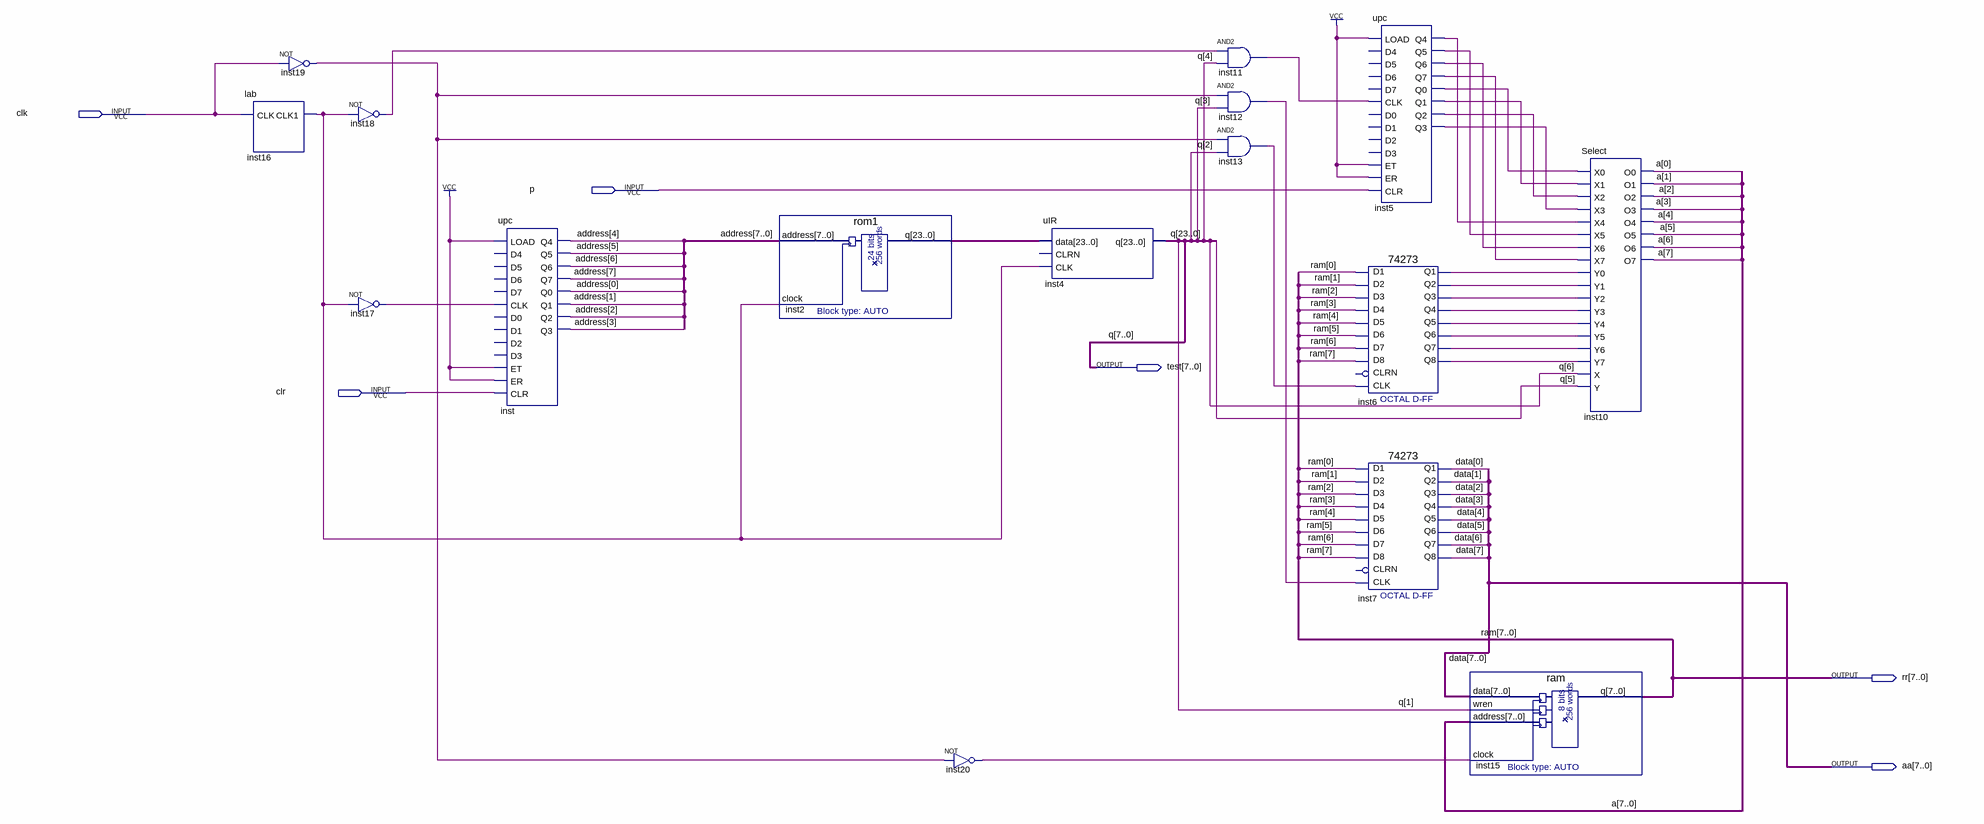
[diagram p0: schematic sheet]
// Quartus schematic lab2.bdf as structural Verilog: 16 symbols, 6 pins
module lab2 (
  input  clk,
  input  p,
  input  clr,
  output [7:0] test,
  output [7:0] rr,
  output [7:0] aa
);

  wire inst5_q0, inst5_q1, inst5_q2, inst5_q3, inst5_q4, inst5_q5, inst5_q6, inst5_q7, inst6_q1, inst6_q2,
       inst6_q3, inst6_q4, inst6_q5, inst6_q6, inst6_q7, inst6_q8, inst11_out, inst12_out, inst13_out,
       inst16_clk1, inst17_out, inst18_out, inst19_out, inst20_out;
  wire [7:0] a, address;
  wire [23:0] inst2_q;
  wire [23:8] q;

  lab inst16 (.CLK(clk), .CLK1(inst16_clk1));
  not inst19 (inst19_out, clk);
  not inst18 (inst18_out, inst16_clk1);
  not inst17 (inst17_out, inst16_clk1);
  upc inst (
    .LOAD(1'b1), .CLK(inst17_out), .ET(1'b1), .ER(1'b1), .CLR(clr), .Q4(address[4]), .Q5(address[5]),
    .Q6(address[6]), .Q7(address[7]), .Q0(address[0]), .Q1(address[1]), .Q2(address[2]), .Q3(address[3]));  // open: D4, D5, D6, D7, D0, D1, D2, D3
  rom1 inst2 (.address(address), .clock(inst16_clk1), .q(inst2_q));
  not inst20 (inst20_out, inst19_out);
  uIR inst4 (.data(inst2_q), .CLK(inst16_clk1), .q({q, test}));  // open: CLRN
  and inst11 (inst11_out, inst18_out, test[4]);
  and inst12 (inst12_out, inst19_out, test[3]);
  and inst13 (inst13_out, inst19_out, test[2]);
  upc inst5 (
    .LOAD(1'b1), .CLK(inst11_out), .ET(1'b1), .ER(1'b1), .CLR(p), .Q4(inst5_q4), .Q5(inst5_q5),
    .Q6(inst5_q6), .Q7(inst5_q7), .Q0(inst5_q0), .Q1(inst5_q1), .Q2(inst5_q2), .Q3(inst5_q3));  // open: D4, D5, D6, D7, D0, D1, D2, D3
  \74273  inst6 (
    .D2(rr[1]), .D3(rr[2]), .D1(rr[0]), .D4(rr[3]), .D7(rr[6]), .D6(rr[5]), .D5(rr[4]), .D8(rr[7]),
    .CLK(inst13_out), .Q4(inst6_q4), .Q1(inst6_q1), .Q2(inst6_q2), .Q3(inst6_q3), .Q6(inst6_q6),
    .Q5(inst6_q5), .Q7(inst6_q7), .Q8(inst6_q8));  // open: CLRN
  \74273  inst7 (
    .D2(rr[1]), .D3(rr[2]), .D1(rr[0]), .D4(rr[3]), .D7(rr[6]), .D6(rr[5]), .D5(rr[4]), .D8(rr[7]),
    .CLK(inst12_out), .Q4(aa[3]), .Q1(aa[0]), .Q2(aa[1]), .Q3(aa[2]), .Q6(aa[5]), .Q5(aa[4]), .Q7(aa[6]),
    .Q8(aa[7]));  // open: CLRN
  ram inst15 (.data(aa), .wren(test[1]), .address(a), .clock(inst20_out), .q(rr));
  Select inst10 (
    .X0(inst5_q0), .X1(inst5_q1), .X2(inst5_q2), .X3(inst5_q3), .X4(inst5_q4), .X5(inst5_q5), .X6(inst5_q6),
    .X7(inst5_q7), .Y0(inst6_q1), .Y1(inst6_q2), .Y2(inst6_q3), .Y3(inst6_q4), .Y4(inst6_q5), .Y5(inst6_q6),
    .Y6(inst6_q7), .Y7(inst6_q8), .X(test[6]), .Y(test[5]), .O0(a[0]), .O1(a[1]), .O2(a[2]), .O3(a[3]),
    .O4(a[4]), .O5(a[5]), .O6(a[6]), .O7(a[7]));

  // Other names for the same wires on the sheet: data[7:0] = aa; ram[7:0] = rr; q[7:0] = test
endmodule
